# EAGLE design WiFi DAC2 (EAGLE 7.6.0)
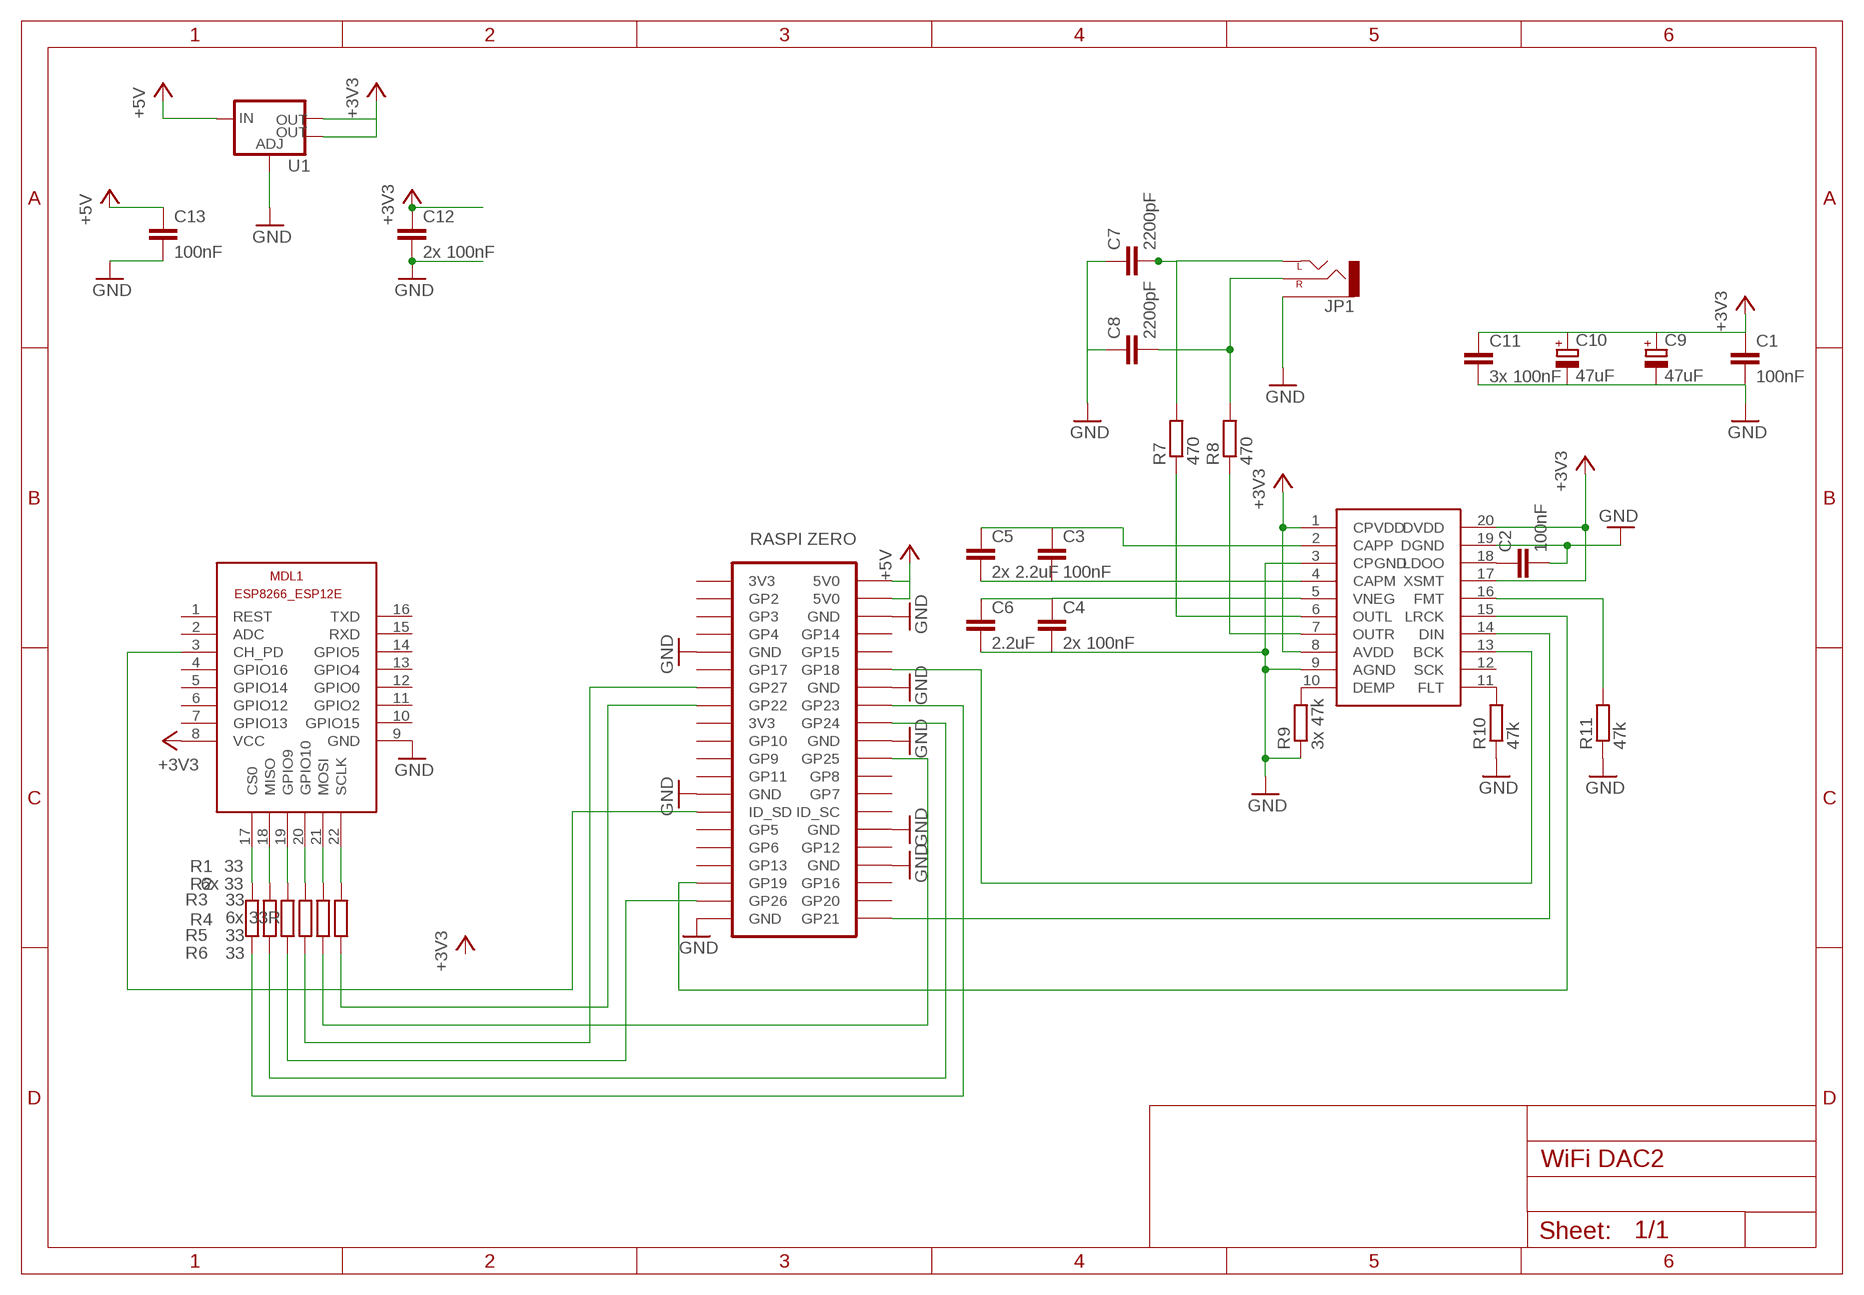
[diagram p0: schematic, sheet 1]

## Parts
C1  100nF  C-EUC0603  [C0603]
C2  100nF  C-EUC0603  [C0603]
C3  100nF  C-EUC0603  [C0603]
C4  2x 100nF  C-EUC0603  [C0603]
C5  2x 2.2uF  C-EUC0603  [C0603]
C6  2.2uF  C-EUC0603  [C0603]
C7  2200pF  C-EUC0603  [C0603]
C8  2200pF  C-EUC0603  [C0603]
C9  47uF  CPOL-EUSANYO_SMD_A5  [SANYO-OSCON_SMD_A5]
C10  47uF  CPOL-EUSANYO_SMD_A5  [SANYO-OSCON_SMD_A5]
C11  3x 100nF  C-EUC0603  [C0603]
C12  2x 100nF  C-EUC0603  [C0603]
C13  100nF  C-EUC0603  [C0603]
JP1  AUDIO-JACKPTH  [AUDIO-JACK]
MDL1  ESP8266-12EESP8266-ESP12E  [ESP8266-ESP12E]
R1  33  R-EU_R0603  [R0603]
R2  6x 33  R-EU_R0603  [R0603]
R3  33  R-EU_R0603  [R0603]
R4  6x 33R  R-EU_R0603  [R0603]
R5  33  R-EU_R0603  [R0603]
R6  33  R-EU_R0603  [R0603]
R7  470  R-EU_R0603  [R0603]
R8  470  R-EU_R0603  [R0603]
R9  3x 47k  R-EU_R0603  [R0603]
R10  47k  R-EU_R0603  [R0603]
R11  47k  R-EU_R0603  [R0603]
U1  V_REG_LM1117SOT223  [SOT223]
U$1  ZERO  [ZERO]
U$2  PCM5102  [TSSOP20]

## Nets
+3V3: C1.1 C9.+ C10.+ C11.1 C12.1 MDL1.8(VCC) U1.2(OUT) U1.4(OUT) U$2.1(CPVDD) U$2.8(AVDD) U$2.17(XSMT) U$2.20(DVDD)
+5V: C13.1 U1.3(IN) U$1.2(5V0) U$1.4(5V0)
GND: C1.2 C2.2 C4.2 C6.2 C7.1 C8.1 C9.- C10.- C11.2 C12.2 C13.2 JP1.SLEEVE MDL1.9(GND) R9.1 R10.1 R11.1 U1.1(ADJ) U$1.6(GND) U$1.9(GND) U$1.14(GND) U$1.20(GND) U$1.25(GND) U$1.30(GND) U$1.34(GND) U$1.39(GND) U$2.3(CPGND) U$2.9(AGND) U$2.19(DGND)
N$1: MDL1.17(CS0) R1.2
N$2: MDL1.18(MISO) R2.2
N$3: MDL1.19(GPIO9) R3.2
N$4: MDL1.20(GPIO10) R4.2
N$5: MDL1.21(MOSI) R5.2
N$6: MDL1.22(SCLK) R6.2
N$7: R1.1 U$1.16(GP23)
N$8: R2.1 U$1.18(GP24)
N$9: R3.1 U$1.37(GP26)
N$10: R4.1 U$1.13(GP27)
N$11: R5.1 U$1.22(GP25)
N$12: R6.1 U$1.15(GP22)
N$13: MDL1.3(CH_PD) U$1.27(ID_SD)
N$14: U$1.35(GP19) U$2.15(LRCK)
N$15: U$1.40(GP21) U$2.14(DIN)
N$16: U$1.12(GP18) U$2.13(BCK)
N$17: C2.1 U$2.18(LDOO)
N$18: C3.2 C5.2 U$2.4(CAPM)
N$19: C3.1 C5.1 U$2.2(CAPP)
N$20: C4.1 C6.1 U$2.5(VNEG)
N$21: C7.2 JP1.TIP(LEFT) R7.2
N$22: C8.2 JP1.RING(RIGHT) R8.2
N$23: R7.1 U$2.6(OUTL)
N$24: R8.1 U$2.7(OUTR)
N$25: R9.2 U$2.10(DEMP)
N$26: R10.2 U$2.11(FLT)
N$27: R11.2 U$2.16(FMT)
Unconnected: MDL1.1(REST) MDL1.2(ADC) MDL1.4(GPIO16) MDL1.5(GPIO14) MDL1.6(GPIO12) MDL1.7(GPIO13) MDL1.10(GPIO15) MDL1.11(GPIO2) MDL1.12(GPIO0) MDL1.13(GPIO4) MDL1.14(GPIO5) MDL1.15(RXD) MDL1.16(TXD) U$1.1(3V3) U$1.3(GP2) U$1.5(GP3) U$1.7(GP4) U$1.8(GP14) U$1.10(GP15) U$1.11(GP17) U$1.17(3V3) U$1.19(GP10) U$1.21(GP9) U$1.23(GP11) U$1.24(GP8) U$1.26(GP7) U$1.28(ID_SC) U$1.29(GP5) U$1.31(GP6) U$1.32(GP12) U$1.33(GP13) U$1.36(GP16) U$1.38(GP20) U$2.12(SCK)

## Library data of the parts
C1-C8 C11-C13 = rcl:C-EU: CAPACITOR, European symbol
C9 C10 = rcl:CPOL-EU: POLARIZED CAPACITOR, European symbol
JP1 = SparkFun-Connectors:AUDIO-JACK: 3.5mm Audio Jack Simple 3.5mm common PCB mount audio jack. Variant PTH is our storefront SKU PRT-08032
MDL1 = ESP12E:ESP8266-12E: ESP8266-12E with additional I/O and GPIO04/05 corrected The author cannot warrant that this library is free from error or will meet your specific requirements. Created by PuceBaboon.com. Komagane, Nagano, JAPAN
R1-R11 = rcl:R-EU_: RESISTOR, European symbol
U1 = SparkFun-PowerIC:V_REG_LM1117: Voltage Regulator LM1117 Standard adjustable voltage regulator but in SMD form. Spark Fun Electronics SKU : COM-00595; PROD_ID: VREG-08170
U$1 = RasPi:ZERO: Raspbery Pi Foundation Zero https://www.raspberrypi.org/products/pi-zero/
U$2 = PCM5102:PCM5102

## Board
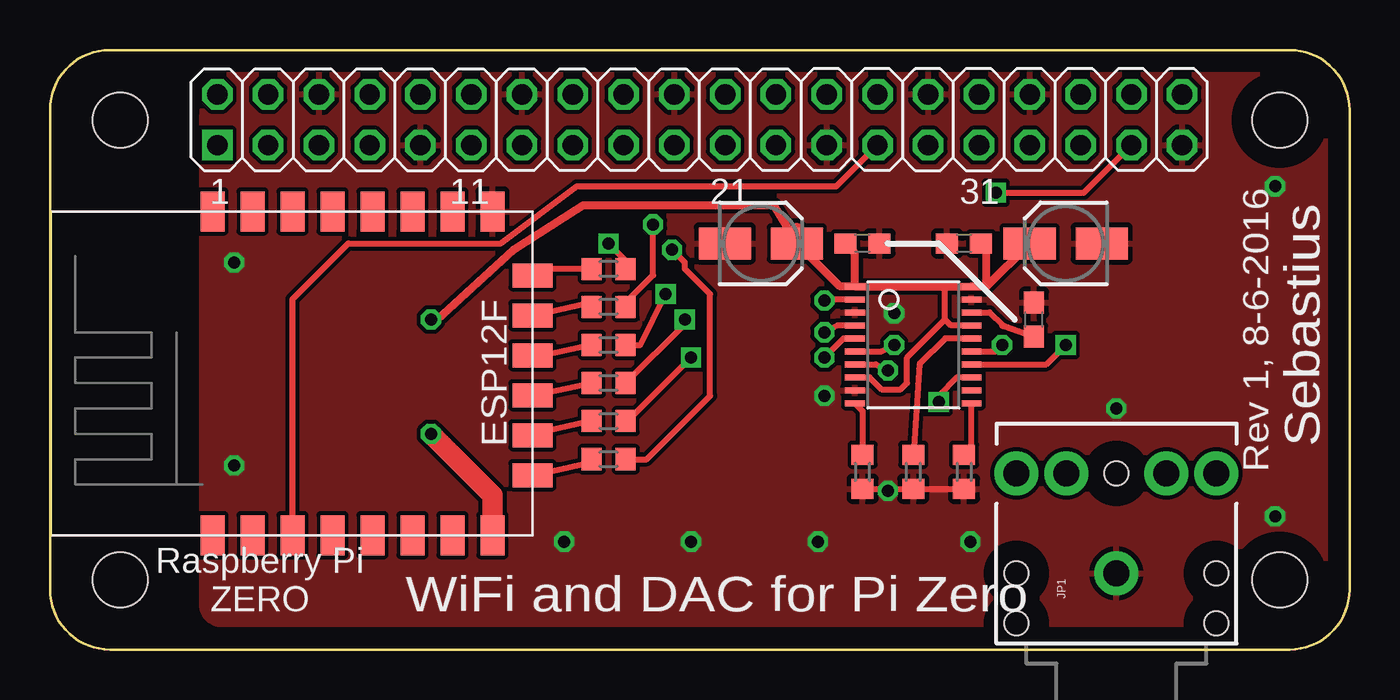
[diagram p1: board, top side]
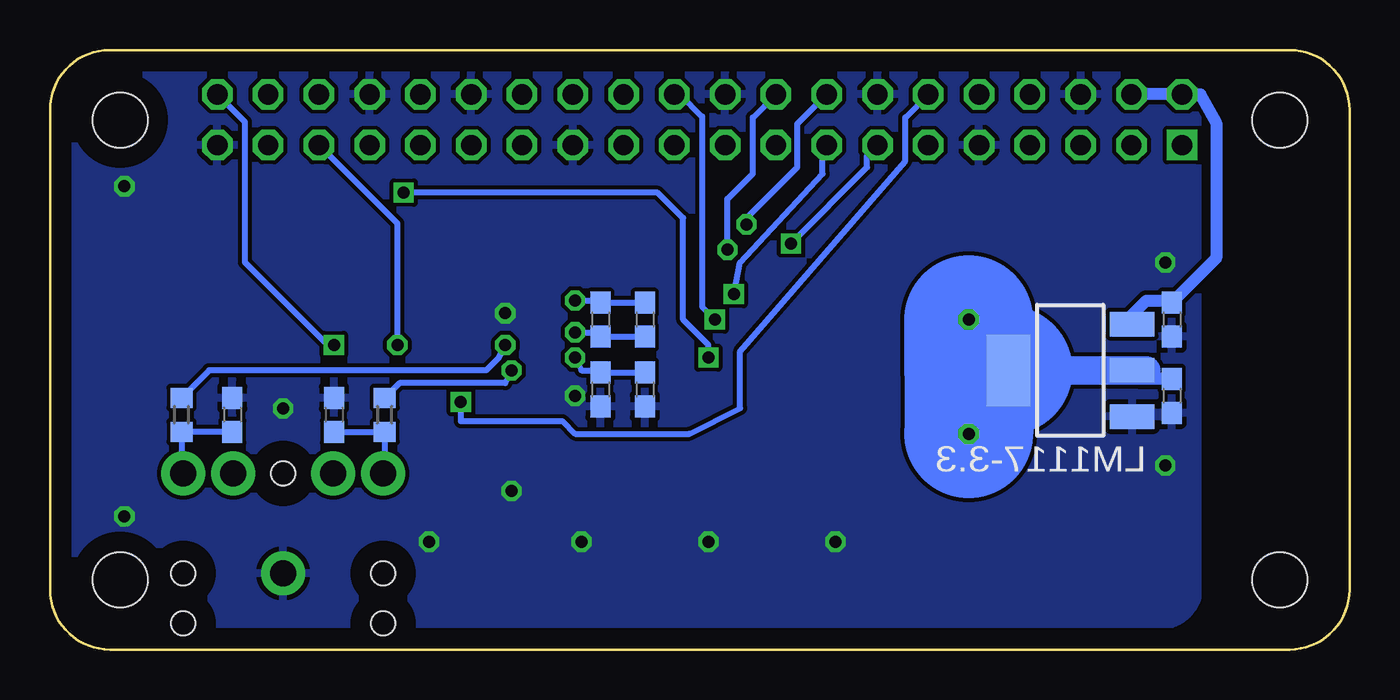
[diagram p2: board, bottom side, seen from below]

Size 65 x 30 mm. Coordinates in mm from the lower left corner, seen from the top.
Copper layers (1*16): Top 0.035mm / dielectric 1.5mm / Bottom 0.035mm
Design rules "default": minimum track width 10mil, minimum drill 24mil, track to track 8mil, track to pad 8mil, pad to pad 8mil, via to via 8mil, smd to smd 8mil, copper to edge 40mil, drill to drill 8mil, minimum pad ring 10mil, minimum via ring 8mil, stop-mask expansion 4mil, vias tented up to drill 0mil, thermal gap 10mil

### Footprints (pad centres in the part's own frame; a part is rotated, then mirrored left to right if it is on the bottom)
C0603 = smd 1.1 x 1: 1 -0.85,0; 2 0.85,0
SANYO-OSCON_SMD_A5 = smd 2.6 x 1.6: + 1.8,0; - -1.8,0
AUDIO-JACK = drill 1.3 pad 2.184: RING 5,5; RSH 5,2.5; SLEEVE 0,0; TIP 5,-5; TSH 5,-2.5 | hole 1.2: 0,5; -2.5,5; -2.5,-5; 0,-5; 5,0
ESP8266-ESP12E = smd 2 x 1.2: 1 0,16; 2 0,14; 3 0,12; 4 0,10; 5 0,8; 6 0,6; 7 0,4; 8 0,2; 9 16.2,2; 10 16.2,4; 11 16.2,6; 12 16.2,8; 13 16.2,10; 14 16.2,12; 15 16.2,14; 16 16.2,16 | smd 1.2 x 2: 17 11,0; 18 3,0; 19 5,0; 20 13,0; 21 7,0; 22 9,0
R0603 = smd 1 x 1.1: 1 -0.85,0; 2 0.85,0
SOT223 = smd 1.219 x 2.235: 1 -2.311,-3.099; 2 0,-3.099; 3 2.311,-3.099 | smd 3.6 x 2.2: 4 0,3.099
ZERO = drill 1.016 square: 1 8.37,25.24 | drill 1.016 octagon: 2 8.37,27.78; 3 10.91,25.24; 4 10.91,27.78; 5 13.45,25.24; 6 13.45,27.78; 7 15.99,25.24; 8 15.99,27.78; 9 18.53,25.24; 10 18.53,27.78; 11 21.07,25.24; 12 21.07,27.78; 13 23.61,25.24; 14 23.61,27.78; 15 26.15,25.24; 16 26.15,27.78; 17 28.69,25.24; 18 28.69,27.78; 19 31.23,25.24; 20 31.23,27.78; 21 33.77,25.24; 22 33.77,27.78; 23 36.31,25.24; 24 36.31,27.78; 25 38.85,25.24; 26 38.85,27.78; 27 41.39,25.24; 28 41.39,27.78; 29 43.93,25.24; 30 43.93,27.78; 31 46.47,25.24; 32 46.47,27.78; 33 49.01,25.24; 34 49.01,27.78; 35 51.55,25.24; 36 51.55,27.78; 37 54.09,25.24; 38 54.09,27.78; 39 56.63,25.24; 40 56.63,27.78 | hole 2.75: 3.5,3.5; 3.5,26.5; 61.5,26.5; 61.5,3.5
TSSOP20 = smd 0.305 x 0.991: 1 -2.925,-2.918; 2 -2.275,-2.918; 3 -1.625,-2.918; 4 -0.975,-2.918; 5 -0.325,-2.918; 6 0.325,-2.918; 7 0.975,-2.918; 8 1.625,-2.918; 9 2.275,-2.918; 10 2.925,-2.918; 11 2.925,2.918; 12 2.275,2.918; 13 1.625,2.918; 14 0.975,2.918; 15 0.325,2.918; 16 -0.325,2.918; 17 -0.975,2.918; 18 -1.625,2.918; 19 -2.275,2.918; 20 -2.925,2.918

### Placement (x,y rotation side)
C1  45.72,20.32 180 top
C2  49.21,16.51 90 top
C3  37.47,16.51 270 bottom
C4  37.47,13.02 270 bottom
C5  35.24,16.51 270 bottom
C6  35.24,13.02 270 bottom
C7  55.88,11.75 270 bottom
C8  50.8,11.75 270 bottom
C9  35.56,20.32 0 top
C10  50.8,20.32 180 top
C11  40.64,20.32 0 top
C12  8.89,12.7 270 bottom
C13  8.89,16.51 270 bottom
JP1  53.34,3.81 90 top
MDL1  24.13,5.71 90 top
R1  27.94,17.14 180 top
R2  27.94,9.53 180 top
R3  27.94,11.43 180 top
R4  27.94,19.05 180 top
R5  27.94,13.34 180 top
R6  27.94,15.24 180 top
R7  58.42,11.75 270 bottom
R8  48.26,11.75 270 bottom
R9  40.64,8.89 90 top
R10  45.72,8.89 90 top
R11  43.18,8.89 90 top
U1  13.97,13.97 90 bottom
U$1  0,0 0 top
U$2  43.18,15.24 270 top

### Tracks (layer width: path | path; a pad name or v marks a point on that pad's centre or on a via)
+3V3  (via drill 0.6)
  Top 0.305: U$2.17 45.06,16.21 44.77,16.51 | 44.77,16.51 44.77,18.16 | U$2.8 40.99,13.62 41.59,13.02 42.55,13.02 42.86,13.34 42.86,14.61 44.77,16.51
  Top 0.406: 46.84,18.16 U$2.20 44.77,18.16 U$2.1 | 46.84,18.16 C10.+ | U$2.1 40.26,19.85 C11.1 | U$2.1 39.52,18.16 C9.+ 36.2,22.23 26.67,22.23 23.18,20 19.37,16.51 v19.05,16.51 | 46.84,18.16 46.84,20.05 C1.1
  Top 0.61: C9.+ 37.36,21.06
  Top 1.016: MDL1.8 22.13,7.71 v19.05,10.79
  Bottom 0.61: C12.1 10.45,13.55 U1.2 16.51,13.97 U1.4
  Bottom 1.422: v19.05,16.51 16.51,13.97 10.16,13.97
  Bottom 6.452: U1.4 19.05,13.97 | 19.05,13.97 v19.05,10.79 | 19.05,13.97 v19.05,16.51
+5V
  Bottom 0.61: U1.3 10.87,16.75 10.16,17.46 8.99,17.46 C13.1 6.67,19.58 6.67,26.35 7.46,27.78 U$1.2 U$1.4
GND  (via drill 0.6)
  Top 0.305: R10.1 R11.1 R9.1 41.81,8.04 v41.91,7.94
  Bottom 0.305: v41.91,7.94 41.91,7.62
  other vias: 38.73,12.7 42.23,16.83 9.21,9.21 9.21,19.37 25.72,5.4 32.07,5.4 38.42,5.4 46.04,5.4 61.28,6.67 61.28,23.18 61.28,23.18 53.34,12.06
  pour Bottom: 62.23,29.21 8.89,29.21 arc90 7.62,26.67 7.62,2.54 arc90 10.16,1.27 62.23,1.27 arc90 64.14,3.17 64.14,27.3 arc90
  pour Top: 7.62,2.22 7.62,26.67 arc-90 10.16,29.21 60.96,29.21 arc-90 63.82,26.35 63.82,2.54 arc-90 62.55,1.27 8.57,1.27 arc-90
N$1
  Top 0.305: MDL1.17 26.89,17.35 R1.2
N$2
  Top 0.305: MDL1.18 26.91,9.35 R2.2
N$3
  Top 0.305: R3.2 24.21,10.79 MDL1.19
N$4
  Top 0.305: R4.2 24.43,19.05 MDL1.20
N$5
  Top 0.305: MDL1.21 27.07,13.35 R5.2
N$6
  Top 0.305: R6.2 24.24,14.61 MDL1.22
N$7  (via drill 0.6)
  Top 0.305: R1.1 28.79,17.36 30.16,18.73 v30.16,21.27
  Bottom 0.305: v30.16,21.27 30.16,21.59 27.62,24.13 27.62,26.31 U$1.16
N$8  (via drill 0.6)
  Top 0.305: R2.1 29.84,9.53 33.02,12.7 33.02,17.78 31.75,19.05 31.75,19.37 v31.11,20
  Bottom 0.305: v31.11,20 31.11,22.54 29.84,23.81 29.84,26.62 U$1.18
N$9  (via drill 0.6)
  Top 0.305: R3.1 28.89,11.43 v32.07,14.61 | v47.31,22.86 51.71,22.86 U$1.37
  Bottom 0.305: v32.07,14.61 32.07,15.24 33.34,16.51 33.34,21.59 34.61,22.86 v47.31,22.86
N$10  (via drill 0.6)
  Top 0.305: R4.1 28.79,19.47 v27.94,20.32
  Bottom 0.305: v27.94,20.32 24.13,24.13 24.13,24.72 U$1.13
N$11  (via drill 0.6)
  Top 0.305: v31.75,16.51 31.75,16.3 R5.1
  Bottom 0.305: U$1.22 33.49,27.78 32.38,26.67 32.38,17.14 v31.75,16.51
N$12  (via drill 0.6)
  Top 0.305: R6.1 29.53,15.24 v30.8,17.78
  Bottom 0.305: v30.8,17.78 30.48,19.37 26.35,23.81 26.35,25.04 U$1.15
N$13
  Top 0.305: MDL1.3 12.13,17.53 14.92,20.32 22.54,20.32 26.35,23.18 39.33,23.18 U$1.27
N$14  (via drill 0.6)
  Top 0.305: U$2.15 47.3,14.91 v47.62,15.24
  Bottom 0.305: v47.62,15.24 47.62,21.32 U$1.35
N$15  (via drill 0.6)
  Top 0.305: U$2.14 49.83,14.27 v50.8,15.24
  Bottom 0.305: v50.8,15.24 51.12,15.24 55.24,19.37 55.24,26.39 U$1.40
N$16  (via drill 0.6)
  Top 0.305: U$2.13 45.37,13.62 44.45,12.7 v44.45,12.38
  Bottom 0.305: v44.45,12.38 44.45,11.43 39.37,11.43 38.73,10.79 33.02,10.79 30.48,12.06 30.48,14.92 22.23,24.45 22.23,26.62 U$1.12
N$17
  Top 0.305: U$2.18 46.99,16.86 47.62,16.23 47.62,16.19 47.73,16.19 C2.1
N$18  (via drill 0.6)
  Top 0.305: U$2.4 39.39,16.21 v38.73,15.88
  Bottom 0.305: v38.73,15.88 37.36,15.88 C3.2 C5.2
N$19  (via drill 0.6)
  Top 0.305: U$2.2 39.1,17.52 v38.73,17.46
  Bottom 0.305: v38.73,17.46 37.57,17.46 C3.1 C5.1
N$20  (via drill 0.6)
  Top 0.305: U$2.5 39.69,15.56 39.05,14.93 v38.73,14.61
  Bottom 0.305: v38.73,14.61 38.42,13.97 37.57,13.97 C4.1 C6.1
N$21
  Bottom 0.305: C7.2 R7.2 58.42,8.89 JP1.TIP
N$22
  Bottom 0.305: C8.2 R8.2 48.26,8.89 JP1.RING
N$23  (via drill 0.6)
  Top 0.305: U$2.6 41.59,14.91 41.59,14.92 v42.22,15.23 v42.23,15.24
  Bottom 0.305: v42.23,15.24 42.55,14.61 43.18,13.97 57.05,13.97 R7.1
N$24  (via drill 0.6)
  Top 0.305: U$2.7 41.3,14.27 v41.91,13.97
  Bottom 0.305: v41.91,13.97 42.23,13.34 47.52,13.34 R8.1
N$25
  Top 0.305: U$2.10 40.64,11.94 R9.2
N$26
  Top 0.305: R10.2 46.1,10.12 U$2.11
N$27
  Top 0.305: U$2.16 44.77,15.56 43.5,14.29 R11.2

### Text on the board
tPlace: ESP12F | Sebastius | Rev 1, 8-6-2016 | WiFi and DAC for Pi Zero
bNames: LM1117-3.3